# Altium schematic sheet 02.SchDoc
size 840 x 594 mm; Разраб.: Гришель; Обозначение документа: ГУИР.421457.001 Э3; Пров.: Станкевич; Т.контр.: Станкевич; Н.контр.: Лихачёв; Утв.: Петровский; Номер листа: 2; Общее количество листов: 2; Литера: Т; Наименование организации: БГУИР, гр. 250701; Наименование изделия 1: Плата отладочная; Наименование изделия 2: Схема электрическая; Наименование изделия 3: принципиальная; Нач. отд.: Реценз.
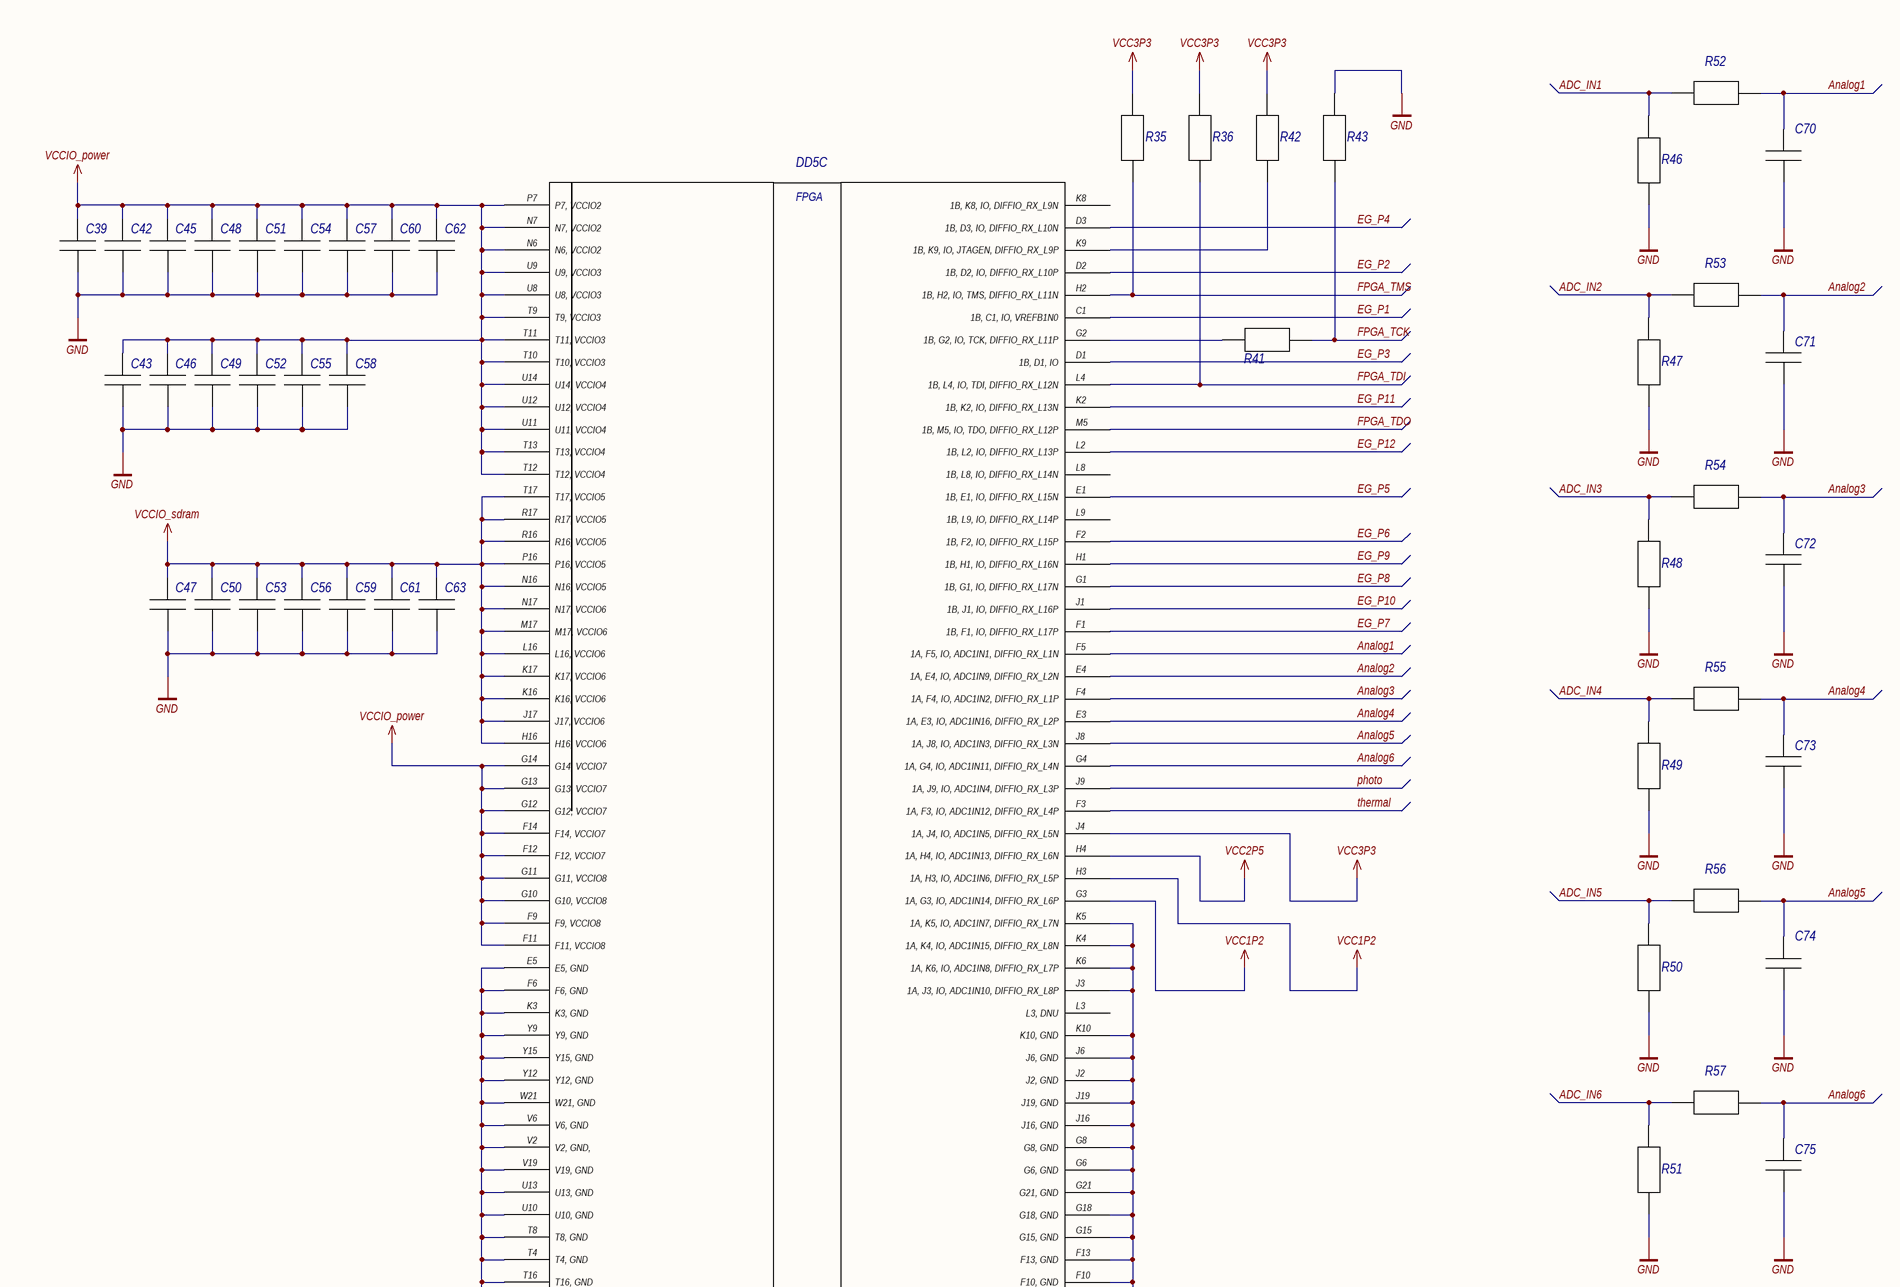
[diagram p0: 02.SchDoc, top left]
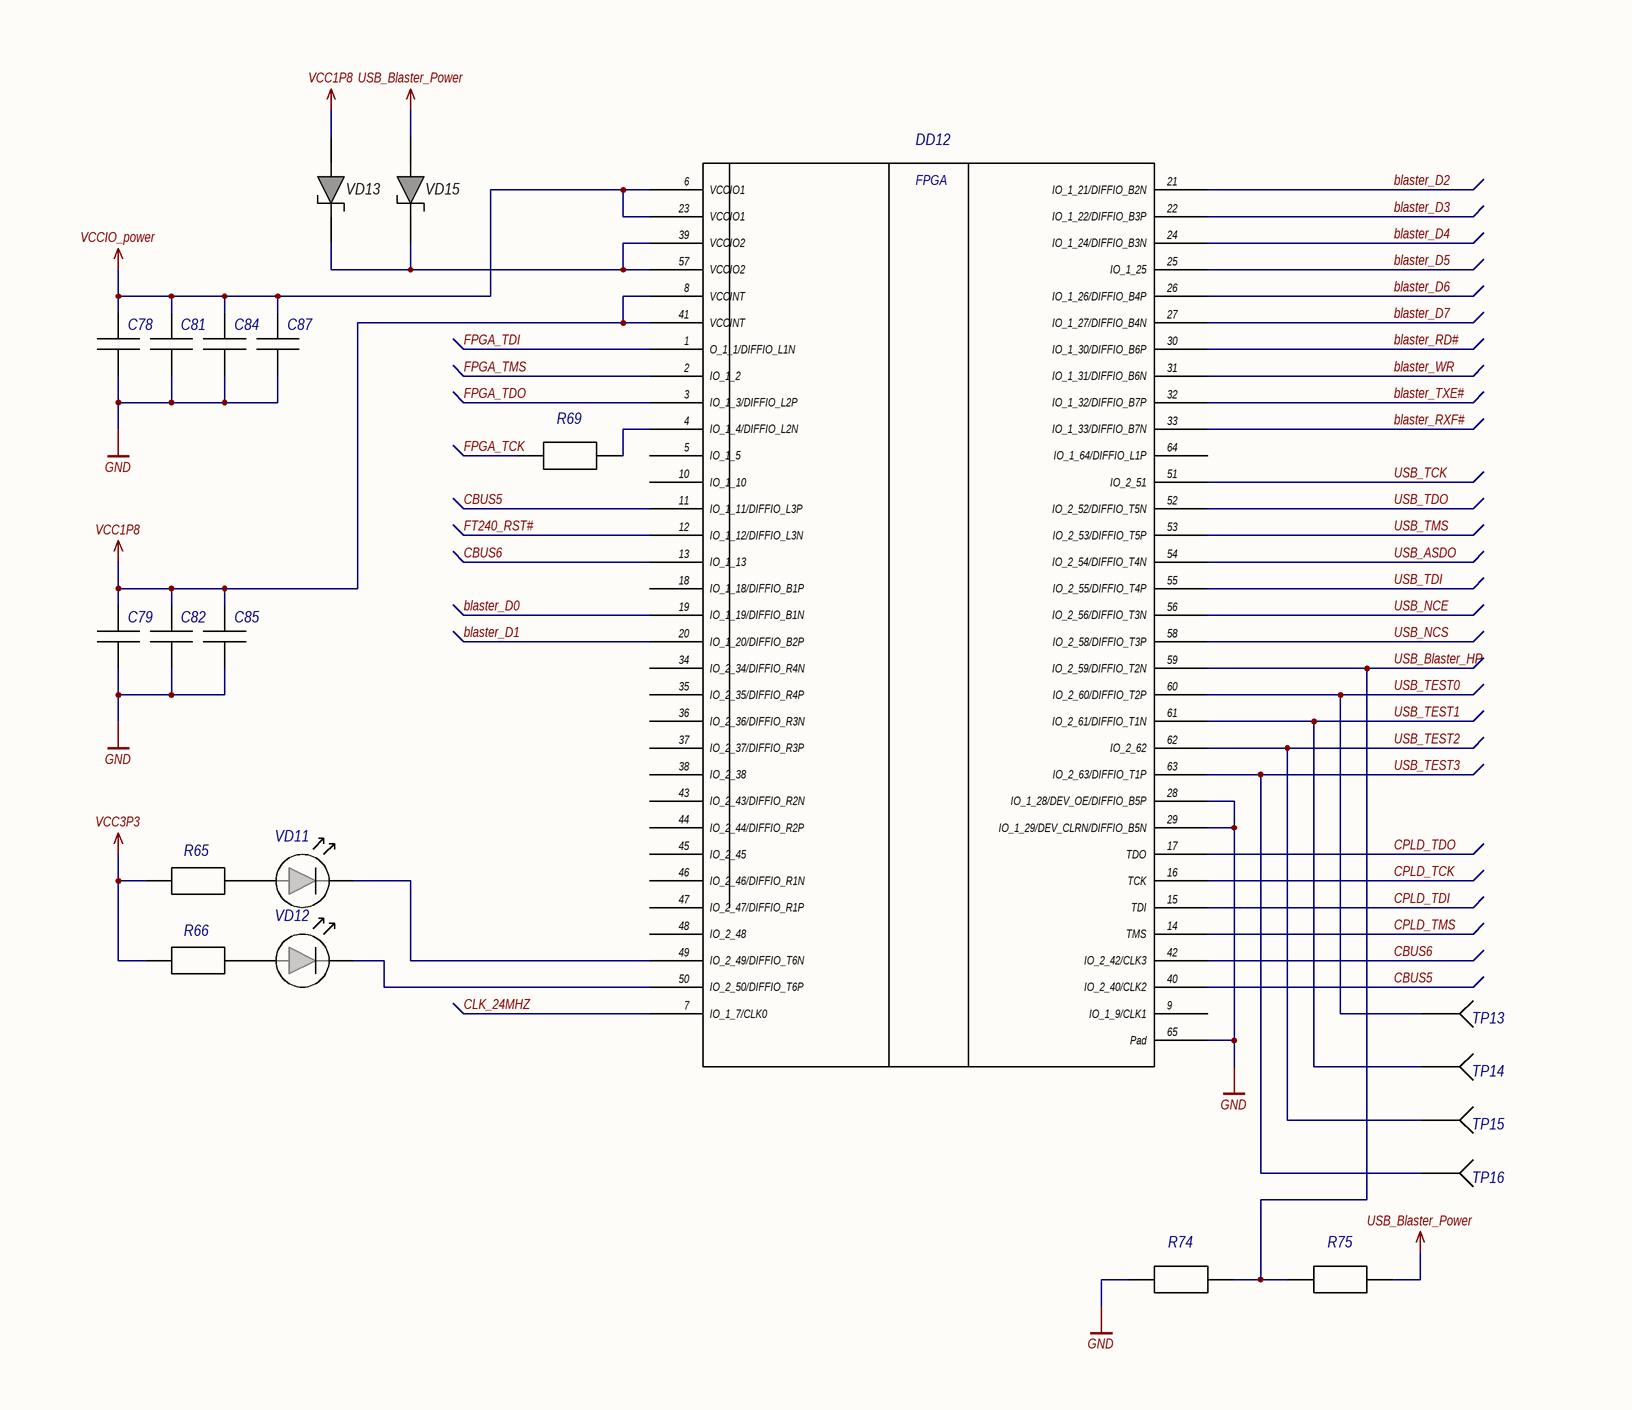
[diagram p1: 02.SchDoc, top right]
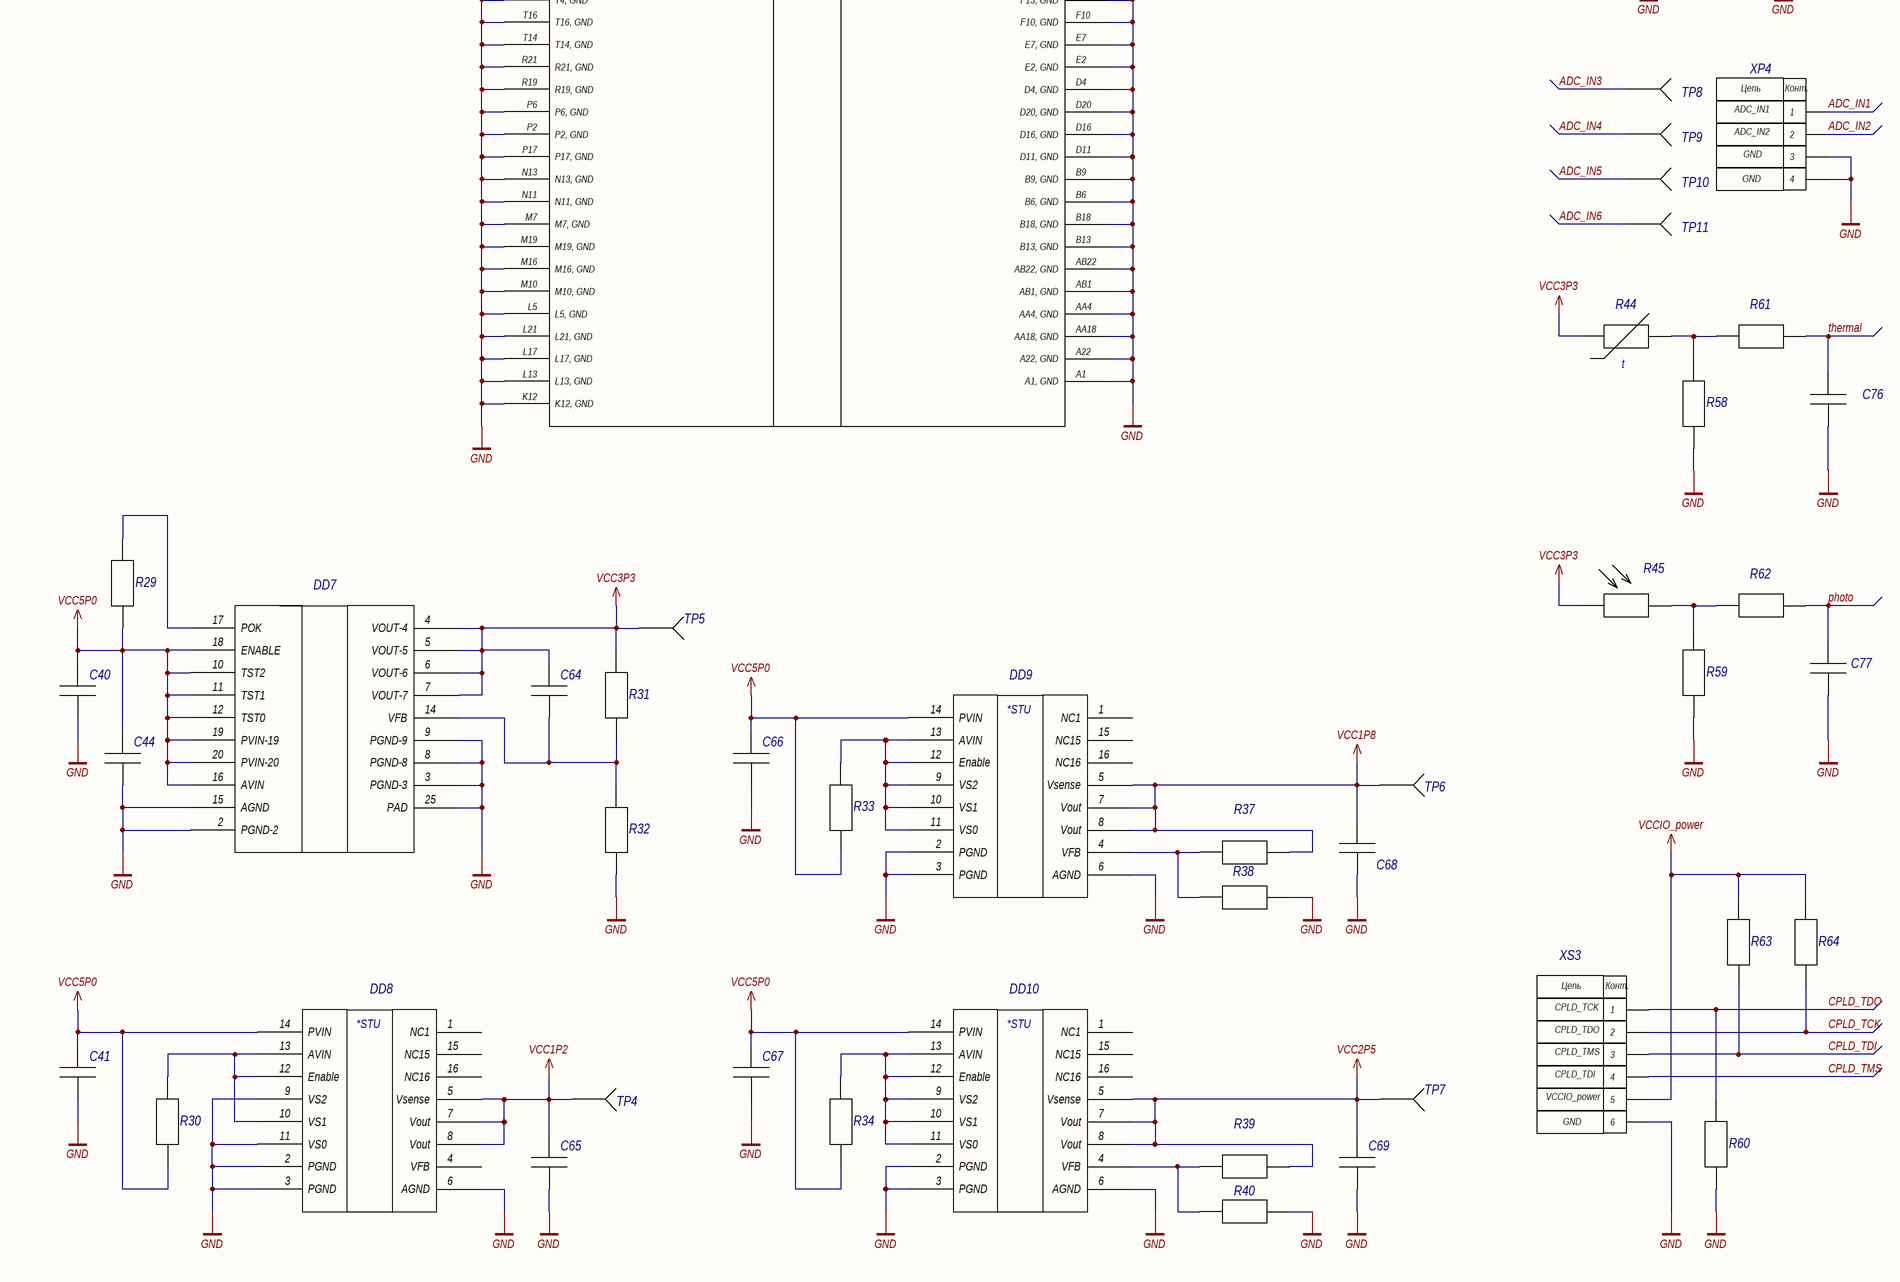
[diagram p2: 02.SchDoc, bottom left]
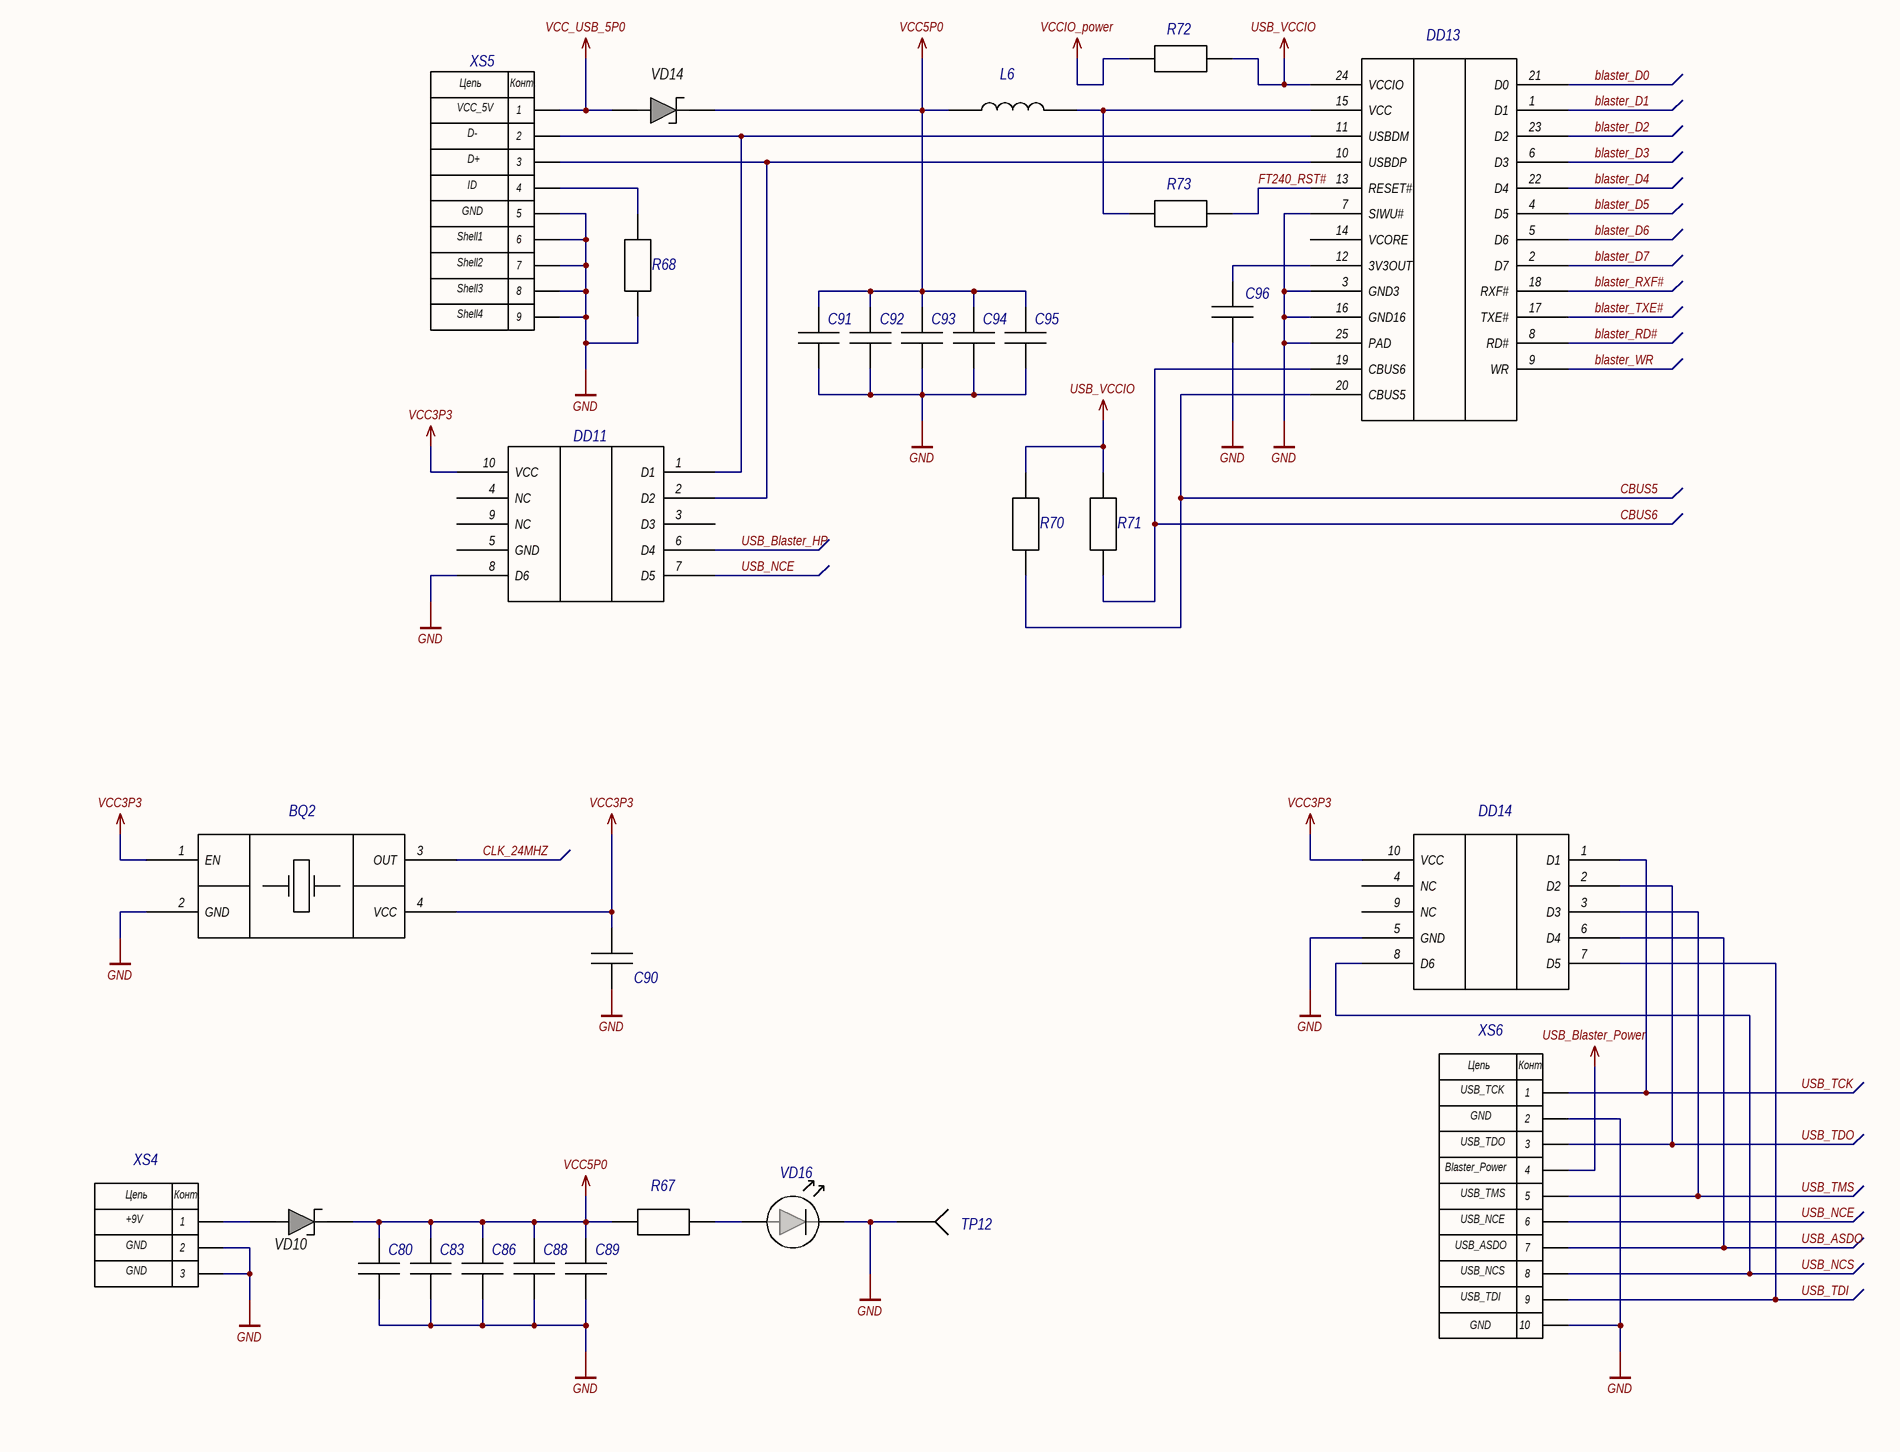
[diagram p3: 02.SchDoc, bottom right]

## Parts
BQ2  Clock 24 MHz 50ppm DNI  [Crystal_Clock_SMD]  (value not drawn)
C39  10u  [Cap_0603]  (value not drawn)
C40  10u  [Cap_0805]  (value not drawn)
C41  4.7u  [Cap_0603]  (value not drawn)
C42  1u  [CAPC0603X03L]  (value not drawn)
C43  10u  [Cap_0603]  (value not drawn)
C44  1u  [Cap_0603]  (value not drawn)
C45  1u  [CAPC0603X03L]  (value not drawn)
C46  1u  [CAPC0603X03L]  (value not drawn)
C47  10u  [Cap_0603]  (value not drawn)
C48  100n  [CAPC0603X03L]  (value not drawn)
C49  100n  [CAPC0603X03L]  (value not drawn)
C50  1u  [CAPC0603X03L]  (value not drawn)
C51  100n  [CAPC0603X03L]  (value not drawn)
C52  100n  [CAPC0603X03L]  (value not drawn)
C53  100n  [CAPC0603X03L]  (value not drawn)
C54  100n  [CAPC0603X03L]  (value not drawn)
C55  10n  [CAPC0603X03L]  (value not drawn)
C56  100n  [CAPC0603X03L]  (value not drawn)
C57  10n  [CAPC0603X03L]  (value not drawn)
C58  10n  [CAPC0603X03L]  (value not drawn)
C59  10n  [CAPC0603X03L]  (value not drawn)
C60  10n  [CAPC0603X03L]  (value not drawn)
C61  10n  [CAPC0603X03L]  (value not drawn)
C62  10n  [CAPC0603X03L]  (value not drawn)
C63  100n  [CAPC0603X03L]  (value not drawn)
C64  6.8p  [CAPC0603X03L]  (value not drawn)
C65  10u  [Cap_0805]  (value not drawn)
C66  4.7u  [Cap_0603]  (value not drawn)
C67  4.7u  [Cap_0603]  (value not drawn)
C68  10u  [Cap_0805]  (value not drawn)
C69  10u  [Cap_0805]  (value not drawn)
C70  100n  [CAPC0603X03L]  (value not drawn)
C71  100n  [CAPC0603X03L]  (value not drawn)
C72  100n  [CAPC0603X03L]  (value not drawn)
C73  100n  [CAPC0603X03L]  (value not drawn)
C74  100n  [CAPC0603X03L]  (value not drawn)
C75  100n  [CAPC0603X03L]  (value not drawn)
C76  100n  [Cap_0402]  (value not drawn)
C77  100n  [Cap_0402]  (value not drawn)
C78  10u  [Cap_0603]  (value not drawn)
C79  10u  [Cap_0603]  (value not drawn)
C80  22u  [Cap_0603]  (value not drawn)
C81  100n  [CAPC0603X03L]  (value not drawn)
C82  100n  [CAPC0603X03L]  (value not drawn)
C83  10u  [Cap_0603]  (value not drawn)
C84  100n  [CAPC0603X03L]  (value not drawn)
C85  100n  [CAPC0603X03L]  (value not drawn)
C86  1u  [Cap_0603]  (value not drawn)
C87  100n  [CAPC0603X03L]  (value not drawn)
C88  100n  [Cap_0603]  (value not drawn)
C89  10n  [Cap_0603]  (value not drawn)
C90  100n  [Cap_0402]  (value not drawn)
C91  10u  [Cap_0603]  (value not drawn)
C92  1u  [CAPC0603X03L]  (value not drawn)
C93  100n  [CAPC0603X03L]  (value not drawn)
C94  22u  [Cap_0603]  (value not drawn)
C95  10n  [CAPC0603X03L]  (value not drawn)
C96  100n  [CAPC0603X03L]  (value not drawn)
DD5  MAX 10 FPGFA  [10M08DAF484_V2]  (value not drawn)  (part C of 3)
DD7  Enpirion Power Supply, Vout 3.3V  - 24 pin  [Enpirion Power Supply_Vout 3.3V _24pin]  (value not drawn)
DD8  Enpirion Power Supply, Vout 2.5V, 1.8V, 1.5V  [Enpirion Power Supply_Vout 2.5V, 1.8V, 1.5V_16pin]  (value not drawn)
DD9  Enpirion Power Supply, Vout 2.5V, 1.8V, 1.5V  [Enpirion Power Supply_Vout 2.5V, 1.8V, 1.5V_16pin]  (value not drawn)
DD10  Enpirion Power Supply, Vout 2.5V, 1.8V, 1.5V  [Enpirion Power Supply_Vout 2.5V, 1.8V, 1.5V_16pin]  (value not drawn)
DD11  ESD for USB Bluster  [ESD_TPD6E001RSER]  (value not drawn)
DD12  MAX V 5M80ZE64  [MAX V 5M80ZE64]  (value not drawn)
DD13  FT240XQ FTDI for USB Bluster 24 pin  [FFTDI_240XQ-T]  (value not drawn)
DD14  ESD for USB Bluster  [ESD_TPD6E001RSER]  (value not drawn)
L6  4.7u  [Inductor]  (value not drawn)
R29  100k  [RESISTOR_0402]  (value not drawn)
R30  100  [RESISTOR_0402]  (value not drawn)
R31  348k  [RESISTOR_0402]  (value not drawn)
R32  76.8k  [RESISTOR_0402]  (value not drawn)
R33  100  [RESISTOR_0402]  (value not drawn)
R34  100  [RESISTOR_0402]  (value not drawn)
R35  10k  [RESISTOR_0402]  (value not drawn)
R36  10k  [RESISTOR_0402]  (value not drawn)
R37  75k  [RESISTOR_0402]  (value not drawn)
R38  118k  [RESISTOR_0402]  (value not drawn)
R39  75k  [RESISTOR_0402]  (value not drawn)
R40  75k  [RESISTOR_0402]  (value not drawn)
R41  22  [RESISTOR_0402]  (value not drawn)
R42  10k  [RESISTOR_0402]  (value not drawn)
R43  1k  [RESISTOR_0402]  (value not drawn)
R44  *  [Thermistor]  (value not drawn)
R45  *  [Light Sensor]  (value not drawn)
R46  49.9k  [RESISTOR_0402]  (value not drawn)
R47  49.9k  [RESISTOR_0402]  (value not drawn)
R48  49.9k  [RESISTOR_0402]  (value not drawn)
R49  49.9k  [RESISTOR_0402]  (value not drawn)
R50  49.9k  [RESISTOR_0402]  (value not drawn)
R51  49.9k  [RESISTOR_0402]  (value not drawn)
R52  12.7  [RESISTOR_0402]  (value not drawn)
R53  12.7  [RESISTOR_0402]  (value not drawn)
R54  12.7  [RESISTOR_0402]  (value not drawn)
R55  12.7  [RESISTOR_0402]  (value not drawn)
R56  12.7  [RESISTOR_0402]  (value not drawn)
R57  12.7  [RESISTOR_0402]  (value not drawn)
R58  1k  [RESISTOR_0402]  (value not drawn)
R59  1k  [RESISTOR_0402]  (value not drawn)
R60  1k  [RESISTOR_0402]  (value not drawn)
R61  12.7  [RESISTOR_0402]  (value not drawn)
R62  12.7  [RESISTOR_0402]  (value not drawn)
R63  10k  [RESISTOR_0402]  (value not drawn)
R64  10k  [RESISTOR_0402]  (value not drawn)
R65  220  [Resistor_0603]  (value not drawn)
R66  220  [Resistor_0603]  (value not drawn)
R67  680  [Resistor_0603]  (value not drawn)
R68  100k  [RESISTOR_0402]  (value not drawn)
R69  22  [RESISTOR_0402]  (value not drawn)
R70  10k  [RESISTOR_0402]  (value not drawn)
R71  10k  [RESISTOR_0402]  (value not drawn)
R72  0  [RESISTOR_0402]  (value not drawn)
R73  10k  [RESISTOR_0402]  (value not drawn)
R74  10k  [RESISTOR_0402]  (value not drawn)
R75  1k  [RESISTOR_0402]  (value not drawn)
TP4  Testpoint  [TP]  (value not drawn)  (no BOM)
TP5  Testpoint  [TP]  (value not drawn)  (no BOM)
TP6  Testpoint  [TP]  (value not drawn)  (no BOM)
TP7  Testpoint  [TP]  (value not drawn)  (no BOM)
TP8  Testpoint  [TP]  (value not drawn)  (no BOM)
TP9  Testpoint  [TP]  (value not drawn)  (no BOM)
TP10  Testpoint  [TP]  (value not drawn)  (no BOM)
TP11  Testpoint  [TP]  (value not drawn)  (no BOM)
TP12  Testpoint  [TP]  (value not drawn)  (no BOM)
TP13  Testpoint  [TP]  (value not drawn)  (no BOM)
TP14  Testpoint  [TP]  (value not drawn)  (no BOM)
TP15  Testpoint  [TP]  (value not drawn)  (no BOM)
TP16  Testpoint  [TP]  (value not drawn)  (no BOM)
VD10  Diode_SMA (D13, D15)  [Diode_VS_SMA]  (value not drawn)
VD11  LED_green  [LED_smd]  (value not drawn)
VD12  LED_green  [LED_smd]  (value not drawn)
VD13  Diode (D9)  [Diode_BAT54C]  (value not drawn)
VD14  Diode_SMA (D13, D15)  [Diode_VS_SMA]  (value not drawn)
VD15  Diode (D9)  [Diode_BAT54C]  (value not drawn)
VD16  LED_red  [LED_smd]  (value not drawn)
XP4  Jumper_J11  [CONN_J11-PIN_HEADER_2x2_2.54mm]  (value not drawn)
XS3  JTAG connection to MAX V  (J6)  [CONN_J6_PIN_HEADER_1x6_2.54mm(DNI)]  (value not drawn)
XS4  Power Jack  (J10)  [CONN_Power_Jack]  (value not drawn)
XS5  Mini USB connector 9pins (J8)  [CONN_MiniUSB]  (value not drawn)
XS6  Edge connector for USB-Blaster output  (J7)  [CONN_J7_PIN_HEADER_2x5_2.54mm(DNI)]  (value not drawn)

## Nets
GND: BQ2.2(GND) C39.1 C40.1 C41.1 C42.1 C43.1 C44.1 C45.1 C46.1 C47.1 C48.1 C49.1 C50.1 C51.1 C52.1 C53.1 C54.1 C55.1 C56.1 C57.1 C58.1 C59.1 C60.1 C61.1 C62.1 C63.1 C65.1 C66.1 C67.1 C68.1 C69.1 C70.1 C71.1 C72.1 C73.1 C74.1 C75.1 C76.1 C77.1 C78.1 C79.1 C80.1 C81.1 C82.1 C83.1 C84.1 C85.1 C86.1 C87.1 C88.1 C89.1 C90.1 C91.1 C92.1 C93.1 C94.1 C95.1 C96.1 DD5.A1(A1,_GND) DD5.A22(A22,_GND) DD5.AA4(AA4,_GND) DD5.AA18(AA18,_GND) DD5.AB1(AB1,_GND) DD5.AB22(AB22,_GND) DD5.B6(B6,_GND) DD5.B9(B9,_GND) DD5.B13(B13,_GND) DD5.B18(B18,_GND) DD5.D4(D4,_GND) DD5.D11(D11,_GND) DD5.D16(D16,_GND) DD5.D20(D20,_GND) DD5.E2(E2,_GND) DD5.E5(E5,_GND) DD5.E7(E7,_GND) DD5.F6(F6,_GND) DD5.F10(F10,_GND) DD5.F13(F13,_GND) DD5.G6(G6,_GND) DD5.G8(G8,_GND) DD5.G15(G15,_GND) DD5.G18(G18,_GND) DD5.G21(G21,_GND) DD5.J2(J2,_GND) DD5.J3(1A,_J3,_IO,_ADC1IN10,_DIFFIO_RX_L8P) DD5.J6(J6,_GND) DD5.J16(J16,_GND) DD5.J19(J19,_GND) DD5.K3(K3,_GND) DD5.K4(1A,_K4,_IO,_ADC1IN15,_DIFFIO_RX_L8N) DD5.K5(1A,_K5,_IO,_ADC1IN7,_DIFFIO_RX_L7N) DD5.K6(1A,_K6,_IO,_ADC1IN8,_DIFFIO_RX_L7P) DD5.K10(K10,_GND) DD5.K12(K12,_GND) DD5.L5(L5,_GND) DD5.L13(L13,_GND) DD5.L17(L17,_GND) DD5.L21(L21,_GND) DD5.M7(M7,_GND) DD5.M10(M10,_GND) DD5.M16(M16,_GND) DD5.M19(M19,_GND) DD5.N11(N11,_GND) DD5.N13(N13,_GND) DD5.P2(P2,_GND) DD5.P6(P6,_GND) DD5.P17(P17,_GND) DD5.R19(R19,_GND) DD5.R21(R21,_GND) DD5.T4(T4,_GND) DD5.T8(T8,_GND) DD5.T14(T14,_GND) DD5.T16(T16,_GND) DD5.U10(U10,_GND) DD5.U13(U13,_GND) DD5.V2(V2,_GND,) DD5.V6(V6,_GND) DD5.V19(V19,_GND) DD5.W21(W21,_GND) DD5.Y9(Y9,_GND) DD5.Y12(Y12,_GND) DD5.Y15(Y15,_GND) DD7.2(PGND-2) DD7.3(PGND-3) DD7.8(PGND-8) DD7.9(PGND-9) DD7.15(AGND) DD7.25(PAD) DD8.2(PGND) DD8.3(PGND) DD8.6(AGND) DD8.9(VS2) DD8.11(VS0) DD8.17 DD9.2(PGND) DD9.3(PGND) DD9.6(AGND) DD9.17 DD10.2(PGND) DD10.3(PGND) DD10.6(AGND) DD10.17 DD11.8(D6) DD12.28(IO_1_28/DEV_OE/DIFFIO_B5P) DD12.29(IO_1_29/DEV_CLRN/DIFFIO_B5N) DD12.65(Pad) DD13.3(GND3) DD13.7(SIWU#) DD13.16(GND16) DD13.25(PAD) DD14.5(GND) R32.1 R38.1 R40.1 R43.2 R46.2 R47.2 R48.2 R49.2 R50.2 R51.2 R58.1 R59.1 R60.1 R68.1 R74.1 TP12.1(Pad) VD16.2 XP4.3 XP4.4 XS3.6 XS4.2 XS4.3 XS5.5 XS5.6 XS5.7 XS5.8 XS5.9 XS6.2 XS6.10
USB_Blaster_Power: R75.2 VD15.2 XS6.4
USB_VCCIO: DD13.24(VCCIO) R70.2 R71.2 R72.2
VCC1P2: C65.2 DD5.G3(1A,_G3,_IO,_ADC1IN14,_DIFFIO_RX_L6P) DD5.H3(1A,_H3,_IO,_ADC1IN6,_DIFFIO_RX_L5P) DD8.5(Vsense) DD8.7(Vout) DD8.8(Vout) TP4.1(Pad)
VCC1P8: C68.2 C79.2 C82.2 C85.2 DD9.5(Vsense) DD9.7(Vout) DD9.8(Vout) DD12.8(VCCINT) DD12.41(VCCINT) R37.1 TP6.1(Pad) VD13.2
VCC2P5: C69.2 DD5.H4(1A,_H4,_IO,_ADC1IN13,_DIFFIO_RX_L6N) DD10.5(Vsense) DD10.7(Vout) DD10.8(Vout) R39.1 TP7.1(Pad)
VCC3P3: BQ2.1(EN) BQ2.4(VCC) C64.2 C90.2 DD5.J4(1A,_J4,_IO,_ADC1IN5,_DIFFIO_RX_L5N) DD7.4(VOUT-4) DD7.5(VOUT-5) DD7.6(VOUT-6) DD7.7(VOUT-7) DD11.10(VCC) DD14.10(VCC) R31.2 R35.2 R36.2 R42.2 R44.1 R45.1 R65.2 R66.2 TP5.1(Pad)
VCC5P0: C40.2 C41.2 C44.2 C66.2 C67.2 C80.2 C83.2 C86.2 C88.2 C89.2 C91.2 C92.2 C93.2 C94.2 C95.2 DD7.10(TST2) DD7.11(TST1) DD7.12(TST0) DD7.16(AVIN) DD7.18(ENABLE) DD7.19(PVIN-19) DD7.20(PVIN-20) DD8.14(PVIN) DD9.14(PVIN) DD10.14(PVIN) L6.1 R29.1 R30.1 R33.1 R34.1 R67.1 VD10.1 VD14.1
VCC_USB_5P0: VD14.2 XS5.1
VCCIO_power: C39.2 C42.2 C43.2 C45.2 C46.2 C48.2 C49.2 C51.2 C52.2 C54.2 C55.2 C57.2 C58.2 C60.2 C62.2 C78.2 C81.2 C84.2 C87.2 DD5.F9(F9,_VCCIO8) DD5.F11(F11,_VCCIO8) DD5.F12(F12,_VCCIO7) DD5.F14(F14,_VCCIO7) DD5.G10(G10,_VCCIO8) DD5.G11(G11,_VCCIO8) DD5.G12(G12,_VCCIO7) DD5.G13(G13,_VCCIO7) DD5.G14(G14,_VCCIO7) DD5.N6(N6,_VCCIO2) DD5.N7(N7,_VCCIO2) DD5.P7(P7,_VCCIO2) DD5.T9(T9,_VCCIO3) DD5.T10(T10,_VCCIO3) DD5.T11(T11,_VCCIO3) DD5.T12(T12,_VCCIO4) DD5.T13(T13,_VCCIO4) DD5.U8(U8,_VCCIO3) DD5.U9(U9,_VCCIO3) DD5.U11(U11,_VCCIO4) DD5.U12(U12,_VCCIO4) DD5.U14(U14,_VCCIO4) DD12.6(VCCIO1) DD12.23(VCCIO1) R63.2 R64.2 R72.1 XS3.5
VCCIO_sdram: C47.2 C50.2 C53.2 C56.2 C59.2 C61.2 C63.2 DD5.H16(H16,_VCCIO6) DD5.J17(J17,_VCCIO6) DD5.K16(K16,_VCCIO6) DD5.K17(K17,_VCCIO6) DD5.L16(L16,_VCCIO6) DD5.M17(M17,_VCCIO6) DD5.N16(N16,_VCCIO5) DD5.N17(N17,_VCCIO6) DD5.P16(P16,_VCCIO5) DD5.R16(R16,_VCCIO5) DD5.R17(R17,_VCCIO5) DD5.T17(T17,_VCCIO5)
ADC_IN1: R46.1 R52.1 XP4.1
ADC_IN2: R47.1 R53.1 XP4.2
ADC_IN3: R48.1 R54.1 TP8.1(Pad)
ADC_IN4: R49.1 R55.1 TP9.1(Pad)
ADC_IN5: R50.1 R56.1 TP10.1(Pad)
ADC_IN6: R51.1 R57.1 TP11.1(Pad)
Analog1: C70.2 DD5.F5(1A,_F5,_IO,_ADC1IN1,_DIFFIO_RX_L1N) R52.2
Analog2: C71.2 DD5.E4(1A,_E4,_IO,_ADC1IN9,_DIFFIO_RX_L2N) R53.2
Analog3: C72.2 DD5.F4(1A,_F4,_IO,_ADC1IN2,_DIFFIO_RX_L1P) R54.2
Analog4: C73.2 DD5.E3(1A,_E3,_IO,_ADC1IN16,_DIFFIO_RX_L2P) R55.2
Analog5: C74.2 DD5.J8(1A,_J8,_IO,_ADC1IN3,_DIFFIO_RX_L3N) R56.2
Analog6: C75.2 DD5.G4(1A,_G4,_IO,_ADC1IN11,_DIFFIO_RX_L4N) R57.2
blaster_D0: DD12.19(IO_1_19/DIFFIO_B1N) DD13.21(D0)
blaster_D1: DD12.20(IO_1_20/DIFFIO_B2P) DD13.1(D1)
blaster_D2: DD12.21(IO_1_21/DIFFIO_B2N) DD13.23(D2)
blaster_D3: DD12.22(IO_1_22/DIFFIO_B3P) DD13.6(D3)
blaster_D4: DD12.24(IO_1_24/DIFFIO_B3N) DD13.22(D4)
blaster_D5: DD12.25(IO_1_25) DD13.4(D5)
blaster_D6: DD12.26(IO_1_26/DIFFIO_B4P) DD13.5(D6)
blaster_D7: DD12.27(IO_1_27/DIFFIO_B4N) DD13.2(D7)
blaster_RD#: DD12.30(IO_1_30/DIFFIO_B6P) DD13.8(RD#)
blaster_RXF#: DD12.33(IO_1_33/DIFFIO_B7N) DD13.18(RXF#)
blaster_TXE#: DD12.32(IO_1_32/DIFFIO_B7P) DD13.17(TXE#)
blaster_WR: DD12.31(IO_1_31/DIFFIO_B6N) DD13.9(WR)
CBUS5: DD12.11(IO_1_11/DIFFIO_L3P) DD12.40(IO_2_40/CLK2) DD13.20(CBUS5) R70.1
CBUS6: DD12.13(IO_1_13) DD12.42(IO_2_42/CLK3) DD13.19(CBUS6) R71.1
CLK_24MHZ: BQ2.3(OUT) DD12.7(IO_1_7/CLK0)
CPLD_TCK: DD12.16(TCK) R64.1 XS3.2
CPLD_TDI: DD12.15(TDI) R63.1 XS3.3
CPLD_TDO: DD12.17(TDO) R60.2 XS3.1
CPLD_TMS: DD12.14(TMS) XS3.4
EG_P1: DD5.C1(1B,_C1,_IO,_VREFB1N0)
EG_P2: DD5.D2(1B,_D2,_IO,_DIFFIO_RX_L10P)
EG_P3: DD5.D1(1B,_D1,_IO)
EG_P4: DD5.D3(1B,_D3,_IO,_DIFFIO_RX_L10N)
EG_P5: DD5.E1(1B,_E1,_IO,_DIFFIO_RX_L15N)
EG_P6: DD5.F2(1B,_F2,_IO,_DIFFIO_RX_L15P)
EG_P7: DD5.F1(1B,_F1,_IO,_DIFFIO_RX_L17P)
EG_P8: DD5.G1(1B,_G1,_IO,_DIFFIO_RX_L17N)
EG_P9: DD5.H1(1B,_H1,_IO,_DIFFIO_RX_L16N)
EG_P10: DD5.J1(1B,_J1,_IO,_DIFFIO_RX_L16P)
EG_P11: DD5.K2(1B,_K2,_IO,_DIFFIO_RX_L13N)
EG_P12: DD5.L2(1B,_L2,_IO,_DIFFIO_RX_L13P)
FPGA_TCK: R41.1 R43.1 R69.1
FPGA_TDI: DD5.L4(1B,_L4,_IO,_TDI,_DIFFIO_RX_L12N) DD12.1(O_1_1/DIFFIO_L1N) R36.1
FPGA_TDO: DD5.M5(1B,_M5,_IO,_TDO,_DIFFIO_RX_L12P) DD12.3(IO_1_3/DIFFIO_L2P)
FPGA_TMS: DD5.H2(1B,_H2,_IO,_TMS,_DIFFIO_RX_L11N) DD12.2(IO_1_2) R35.1
FT240_RST#: DD12.12(IO_1_12/DIFFIO_L3N) DD13.13(RESET#) R73.2
photo: C77.2 DD5.J9(1A,_J9,_IO,_ADC1IN4,_DIFFIO_RX_L3P) R62.1
thermal: C76.2 DD5.F3(1A,_F3,_IO,_ADC1IN12,_DIFFIO_RX_L4P) R61.1
USB_ASDO: DD12.54(IO_2_54/DIFFIO_T4N) DD14.6(D4) XS6.7
USB_Blaster_HP: DD11.6(D4) DD12.59(IO_2_59/DIFFIO_T2N) R74.2 R75.1
USB_NCE: DD11.7(D5) DD12.56(IO_2_56/DIFFIO_T3N) XS6.6
USB_NCS: DD12.58(IO_2_58/DIFFIO_T3P) DD14.8(D6) XS6.8
USB_TCK: DD12.51(IO_2_51) DD14.1(D1) XS6.1
USB_TDI: DD12.55(IO_2_55/DIFFIO_T4P) DD14.7(D5) XS6.9
USB_TDO: DD12.52(IO_2_52/DIFFIO_T5N) DD14.2(D2) XS6.3
USB_TEST0: DD12.60(IO_2_60/DIFFIO_T2P) TP13.1(Pad)
USB_TEST1: DD12.61(IO_2_61/DIFFIO_T1N) TP14.1(Pad)
USB_TEST2: DD12.62(IO_2_62) TP15.1(Pad)
USB_TEST3: DD12.63(IO_2_63/DIFFIO_T1P) TP16.1(Pad)
USB_TMS: DD12.53(IO_2_53/DIFFIO_T5P) DD14.3(D3) XS6.5
NetC64_1: C64.1 DD7.14(VFB) R31.1 R32.2
NetC96_2: C96.2 DD13.12(3V3OUT)
NetDD5_G2: DD5.G2(1B,_G2,_IO,_TCK,_DIFFIO_RX_L11P) R41.2
NetDD5_K9: DD5.K9(1B,_K9,_IO,_JTAGEN,_DIFFIO_RX_L9P) R42.1
NetDD7_17: DD7.17(POK) R29.2
NetDD8_10: DD8.10(VS1) DD8.12(Enable) DD8.13(AVIN) R30.2
NetDD9_4: DD9.4(VFB) R37.2 R38.2
NetDD9_9: DD9.9(VS2) DD9.10(VS1) DD9.11(VS0) DD9.12(Enable) DD9.13(AVIN) R33.2
NetDD10_4: DD10.4(VFB) R39.2 R40.2
NetDD10_9: DD10.9(VS2) DD10.10(VS1) DD10.11(VS0) DD10.12(Enable) DD10.13(AVIN) R34.2
NetDD11_1: DD11.1(D1) DD13.11(USBDM) XS5.2
NetDD11_2: DD11.2(D2) DD13.10(USBDP) XS5.3
NetDD12_4: DD12.4(IO_1_4/DIFFIO_L2N) R69.2
NetDD12_39: DD12.39(VCCIO2) DD12.57(VCCIO2) VD13.1 VD15.1
NetDD12_49: DD12.49(IO_2_49/DIFFIO_T6N) VD11.2
NetDD12_50: DD12.50(IO_2_50/DIFFIO_T6P) VD12.2
NetDD13_15: DD13.15(VCC) L6.2 R73.1
NetR44_2: R44.2 R58.2 R61.2
NetR45_2: R45.2 R59.2 R62.2
NetR65_1: R65.1 VD11.1
NetR66_1: R66.1 VD12.1
NetR67_2: R67.2 VD16.1
NetR68_2: R68.2 XS5.4
NetVD10_2: VD10.2 XS4.1

Not connected (* = marked no-connect by the designer): DD5 K8(1B,_K8,_IO,_DIFFIO_RX_L9N) L3(L3,_DNU) L8(1B,_L8,_IO,_DIFFIO_RX_L14N) L9(1B,_L9,_IO,_DIFFIO_RX_L14P); DD8 1(NC1) 4(VFB) 15(NC15) 16(NC16); DD9 1(NC1) 15(NC15) 16(NC16); DD10 1(NC1) 15(NC15) 16(NC16); DD11 3(D3) 4(NC) 5(GND) 9(NC); DD12 5(IO_1_5) 9(IO_1_9/CLK1) 10(IO_1_10) 18(IO_1_18/DIFFIO_B1P) 34(IO_2_34/DIFFIO_R4N) 35(IO_2_35/DIFFIO_R4P) 36(IO_2_36/DIFFIO_R3N) 37(IO_2_37/DIFFIO_R3P) 38(IO_2_38) 43(IO_2_43/DIFFIO_R2N) 44(IO_2_44/DIFFIO_R2P) 45(IO_2_45) 46(IO_2_46/DIFFIO_R1N) 47(IO_2_47/DIFFIO_R1P) 48(IO_2_48) 64(IO_1_64/DIFFIO_L1P); DD13 14(VCORE); DD14 4(NC) 9(NC)

## Notes on the sheet
- Подп. и дата
- Инв. № дубл.
- Взам. инв. №
- Инв. № подл.
- Изм.
- Лист
- № докум.
- Подп.
- Дата
- Копировал
- Формат А1
- (in symbol Edge connector for USB-Blaster output  (J7)) Цепь; Конт.; USB_TCK; GND; USB_TDO; Blaster_Power; USB_TMS; USB_NCE; USB_ASDO; USB_NCS; USB_TDI
- (in symbol Enpirion Power Supply, Vout 2.5V, 1.8V, 1.5V) *STU
- (in symbol JTAG connection to MAX V  (J6)) Цепь; Конт.; CPLD_TCK; CPLD_TDO; CPLD_TMS; CPLD_TDI; VCCIO_power; GND
- (in symbol Jumper_J11) Цепь; Конт.; ADC_IN1; ADC_IN2; GND
- (in symbol MAX 10 FPGFA, part C) FPGA
- (in symbol MAX V 5M80ZE64) FPGA
- (in symbol Mini USB connector 9pins (J8)) Цепь; Конт.; VCC_5V; D-; D+; ID; GND; Shell1; Shell2; Shell3; Shell4
- (in symbol Power Jack  (J10)) Цепь; Конт.; +9V; GND
- (in symbol Res_Thermistor) t

## Library data of the parts
BQ2 = Clock 24 MHz 50ppm DNI: Clock 24 MHz  secondary clock   3.2x2.5 mm; Manufacturer: Silicon Labs; Name: 501HAA24M0000CAFR
C39 C41 C43 C44 C47 C66 C67 C78-C80 C83 C86 C88 C89 C91 C94 = Cap_0603: Non-polar Capacitor
  C39 C43 C47 C78 C79 C83 C91: Value: 10u
  C41 C66 C67: Value: 4.7u
  C44 C86: Value: 1u
  C80 C94: Value: 22u
  C88: Value: 100n
  C89: Value: 10n
C40 C65 C68 C69 = Cap_0805: Non-polar Capacitor; Value: 10u
C42 C45 C46 C48-C64 C70-C75 C81 C82 C84 C85 C87 C92 C93 C95 C96 = Cap_0201: Non-polar Capacitor
  C42 C45 C46 C50 C92: Value: 1u
  C48 C49 C51-C54 C56 C63 C70-C75 C81 C82 C84 C85 C87 C93 C96: Value: 100n
  C55 C57-C62 C95: Value: 10n
  C64: Value: 6.8p
C76 C77 C90 = Cap_0402: Non-polar Capacitor; Value: 100n
DD5 = MAX 10 FPGFA: MAX10 10M08DAF484; Manufacturer: ALTERA; Name: 10M08DAF484C8GES
DD7 = Enpirion Power Supply, Vout 3.3V  - 24 pin: EN5329QI 24-pin (4 x 6 x 1.1mm) QFN T&R; 3.3; Manufacturer: ALTERA; Name: EN5329QI
DD8-DD10 = Enpirion Power Supply, Vout 2.5V, 1.8V, 1.5V: EP53A8LQI 16-pin QFN T&R;  2.5, 1.8, 1.2; Manufacturer: ALTERA; Name: EP53A8LQI
DD11 DD14 = ESD for USB Bluster: TPD6E001RSER, ESD QFN10-RSE; Manufacturer: Texas Instruments; Name: TPD6E001RSER
DD12 = MAX V 5M80ZE64: required for USB Blaster  SQFP7x7-64-EXP; Manufacturer: ALTERA; Name: 5M80ZE64C5N
DD13 = FT240XQ FTDI for USB Bluster 24 pin: FT240XQ FTDI for USB Bluster; Name: FT240XQ-T; Manufacturer: FTDI
L6 = Inductor: Inductor  4.7uH/600mA; Manufacturer: Murata; Name: LQM18PN4R7MFR; Value: 4.7u
R29-R43 R46-R64 R68-R75 = Res_0402: Resistor
  R29 R68: Value: 100k
  R30 R33 R34: Value: 100
  R31: Value: 348k
  R32: Value: 76.8k
  R35 R36 R42 R63 R64 R70 R71 R73 R74: Value: 10k
  R37 R39 R40: Value: 75k
  R38: Value: 118k
  R41 R69: Value: 22
  R43 R58-R60 R75: Value: 1k
  R46-R51: Value: 49.9k
  R52-R57 R61 R62: Value: 12.7
  R72: Value: 0
R44 = Res_Thermistor: Resistor; Value: *
R45 = Res_Photoresistor: CDS Photo Resistor PGM5526  Light sensor; Manufacturer: Token; Value: *; Name: PGM5526
R65-R67 = Res_0603: Resistor
  R65 R66: Value: 220
  R67: Value: 680
TP4-TP16 = Testpoint: Standard Testing Point
VD10 VD14 = Diode_SMA (D13, D15): DIODE SCHOTTKY B360A 60V 0,5mA SMA; Manufacturer: Diodes Incorporated; Name: B360A
VD11 VD12 = LED_green: LED GREEN CLEAR 2.3V 30mA 8-bit output, two for status; Manufacturer: Bet Lux Electronics; Name: BL-LS0603GC SMD
VD13 VD15 = Diode (D9): DIODE SCHOTTKY  BAT54C 30V 200mA SOT23; Manufacturer: Fairchild Semiconductor; Name: BAT54C
VD16 = LED_red: LED RED CLEAR 2.2V 30mA Power led; Manufacturer: Bet Lux Electronics; Name: BL-LS0603HC SMD
XP4 = Jumper_J11: Jumper Analog input (AIN1 and AIN2)  4 pin 2x2_2.54mm; Name: Jumper Analog input (AIN1 and AIN2)  4 pin 2x2_2.54mm
XS3 = JTAG connection to MAX V  (J6): PIN_HEADER_1x6_2.54mm(DNI); Name: PIN_HEADER_1x6_2.54mm(DNI)
XS4 = Power Jack  (J10): Power Jack, 4.5mm_1.3mm
XS5 = Mini USB connector 9pins (J8): USB-Blaster connector; Name: Mini USB connector
XS6 = Edge connector for USB-Blaster output  (J7): PIN_HEADER_2x5_2.54mm(DNI); Name: PIN_HEADER_2x5_2.54mm(DNI)